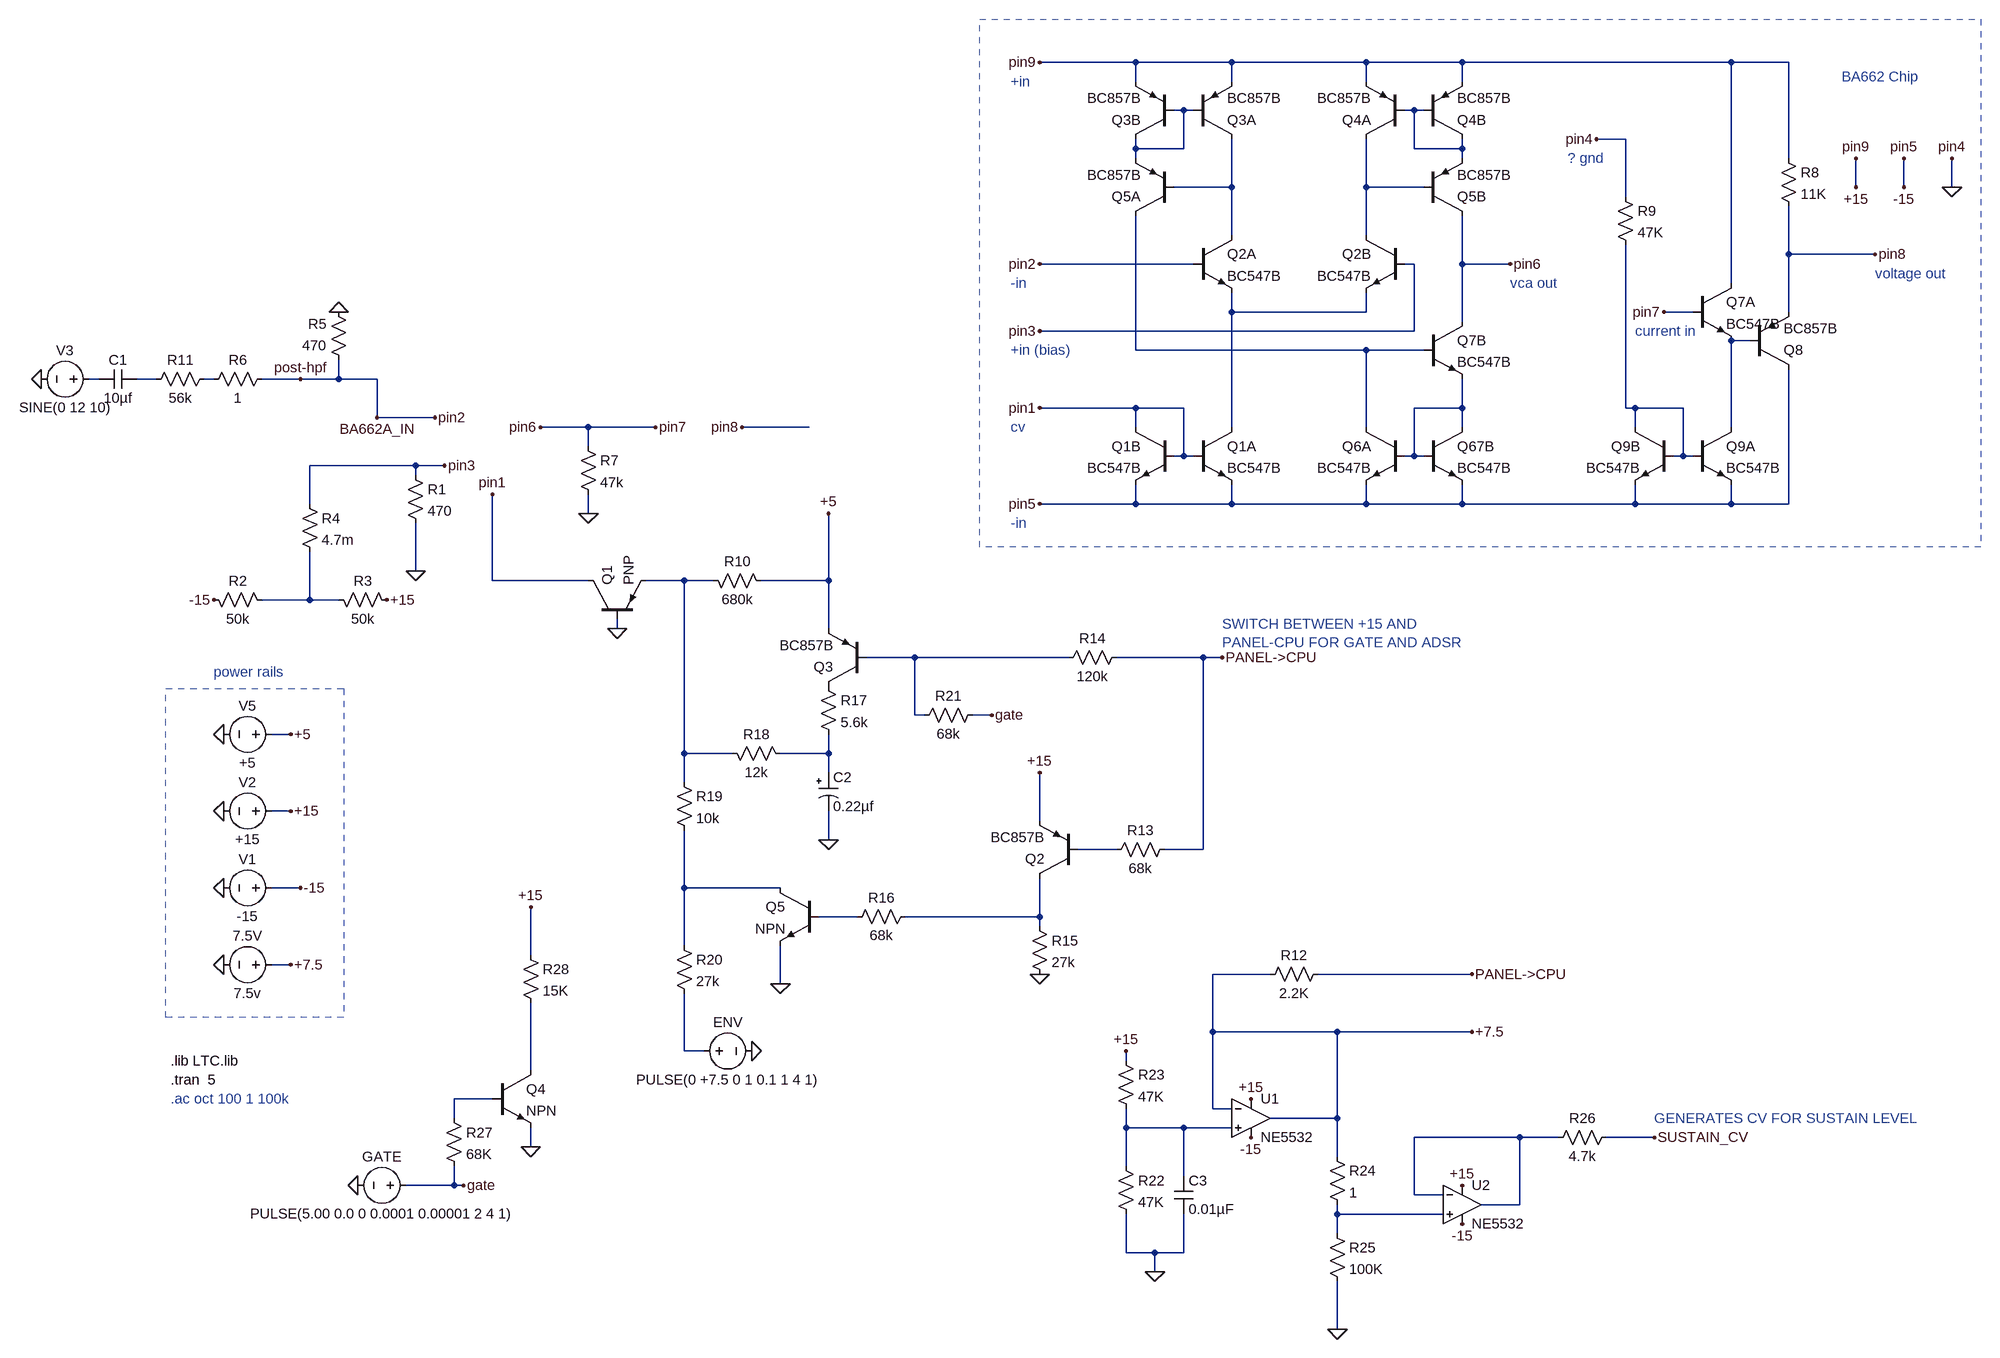
[diagram p0: schematic BA662A VCA (Juno Implementation).asc]
BA662A VCA (Juno Implementation).asc, the LTspice schematic file:
Version 4
SHEET 1 3104 2628
WIRE 1376 -208 1216 -208
WIRE 1536 -208 1376 -208
WIRE 1760 -208 1536 -208
WIRE 1920 -208 1760 -208
WIRE 2368 -208 1920 -208
WIRE 2464 -208 2368 -208
WIRE 1376 -176 1376 -208
WIRE 1536 -176 1536 -208
WIRE 1760 -176 1760 -208
WIRE 1920 -176 1920 -208
WIRE 1456 -128 1440 -128
WIRE 1472 -128 1456 -128
WIRE 1840 -128 1824 -128
WIRE 1856 -128 1840 -128
WIRE 2192 -80 2144 -80
WIRE 1376 -64 1376 -80
WIRE 1456 -64 1456 -128
WIRE 1456 -64 1376 -64
WIRE 1840 -64 1840 -128
WIRE 1920 -64 1920 -80
WIRE 1920 -64 1840 -64
WIRE 1376 -48 1376 -64
WIRE 1920 -48 1920 -64
WIRE 2464 -48 2464 -208
WIRE 1536 0 1536 -80
WIRE 1536 0 1440 0
WIRE 1760 0 1760 -80
WIRE 1856 0 1760 0
WIRE 2576 0 2576 -48
WIRE 2656 0 2656 -48
WIRE 2736 0 2736 -48
WIRE 2192 16 2192 -80
WIRE 1536 80 1536 0
WIRE 1760 80 1760 0
WIRE 2464 112 2464 32
WIRE 2608 112 2464 112
WIRE 1472 128 1216 128
WIRE 1840 128 1824 128
WIRE 1920 128 1920 48
WIRE 2000 128 1920 128
WIRE 2368 160 2368 -208
WIRE 1536 208 1536 176
WIRE 1760 208 1760 176
WIRE 1760 208 1536 208
WIRE 2304 208 2256 208
WIRE 2464 208 2464 112
WIRE 1920 224 1920 128
WIRE 1840 240 1840 128
WIRE 1840 240 1216 240
WIRE 2400 256 2368 256
WIRE 1376 272 1376 48
WIRE 1760 272 1376 272
WIRE 1856 272 1760 272
WIRE -352 320 -368 320
WIRE -256 320 -288 320
WIRE -160 320 -176 320
WIRE -16 320 -80 320
WIRE 48 320 48 288
WIRE 48 320 -16 320
WIRE 112 320 48 320
WIRE 1376 368 1216 368
WIRE 1456 368 1376 368
WIRE 1920 368 1920 320
WIRE 1920 368 1840 368
WIRE 2192 368 2192 96
WIRE 2208 368 2192 368
WIRE 2288 368 2208 368
WIRE 112 384 112 320
WIRE 208 384 112 384
WIRE 464 400 384 400
WIRE 576 400 464 400
WIRE 832 400 720 400
WIRE 1376 400 1376 368
WIRE 1536 400 1536 208
WIRE 1760 400 1760 272
WIRE 1920 400 1920 368
WIRE 2208 400 2208 368
WIRE 2368 400 2368 256
WIRE 464 432 464 400
WIRE 1456 448 1456 368
WIRE 1456 448 1440 448
WIRE 1472 448 1456 448
WIRE 1840 448 1840 368
WIRE 1840 448 1824 448
WIRE 1856 448 1840 448
WIRE 2288 448 2288 368
WIRE 2288 448 2272 448
WIRE 2304 448 2288 448
WIRE 176 464 0 464
WIRE 224 464 176 464
WIRE 176 480 176 464
WIRE 0 528 0 464
WIRE 1376 528 1376 496
WIRE 1376 528 1216 528
WIRE 1536 528 1536 496
WIRE 1536 528 1376 528
WIRE 1760 528 1760 496
WIRE 1760 528 1536 528
WIRE 1920 528 1920 496
WIRE 1920 528 1760 528
WIRE 2208 528 2208 496
WIRE 2208 528 1920 528
WIRE 2368 528 2368 496
WIRE 2368 528 2208 528
WIRE 2464 528 2464 304
WIRE 2464 528 2368 528
WIRE 464 544 464 512
WIRE 176 640 176 560
WIRE 304 656 304 512
WIRE 464 656 304 656
WIRE 624 656 560 656
WIRE 672 656 624 656
WIRE 864 656 864 544
WIRE 864 656 752 656
WIRE 0 688 0 608
WIRE 0 688 -80 688
WIRE 48 688 0 688
WIRE 512 736 512 720
WIRE 864 736 864 656
WIRE 1008 784 928 784
WIRE 1264 784 1008 784
WIRE 1488 784 1344 784
WIRE 1520 784 1488 784
WIRE 1008 880 1008 784
WIRE 1024 880 1008 880
WIRE 1136 880 1104 880
WIRE -32 912 -64 912
WIRE 624 944 624 656
WIRE 704 944 624 944
WIRE 864 944 864 912
WIRE 864 944 784 944
WIRE 864 976 864 944
WIRE 624 992 624 944
WIRE -32 1040 -64 1040
WIRE 1216 1056 1216 976
WIRE 864 1088 864 1040
WIRE 1344 1104 1280 1104
WIRE 1488 1104 1488 784
WIRE 1488 1104 1424 1104
WIRE -16 1168 -64 1168
WIRE 624 1168 624 1072
WIRE 784 1168 624 1168
WIRE 912 1216 848 1216
WIRE 1216 1216 1216 1152
WIRE 1216 1216 992 1216
WIRE 1216 1232 1216 1216
WIRE 624 1264 624 1168
WIRE 368 1280 368 1200
WIRE -32 1296 -64 1296
WIRE 1600 1312 1504 1312
WIRE 1936 1312 1680 1312
WIRE 784 1328 784 1264
WIRE 1504 1408 1504 1312
WIRE 1712 1408 1504 1408
WIRE 1936 1408 1712 1408
WIRE 624 1440 624 1344
WIRE 656 1440 624 1440
WIRE 1360 1456 1360 1440
WIRE 368 1472 368 1360
WIRE 304 1520 240 1520
WIRE 1504 1536 1504 1408
WIRE 1536 1536 1504 1536
WIRE 240 1552 240 1520
WIRE 1712 1552 1712 1408
WIRE 1712 1552 1600 1552
WIRE 1360 1568 1360 1536
WIRE 1456 1568 1360 1568
WIRE 1536 1568 1456 1568
WIRE 2016 1584 1840 1584
WIRE 2080 1584 2016 1584
WIRE 2240 1584 2160 1584
WIRE 368 1600 368 1568
WIRE 1712 1616 1712 1552
WIRE 1360 1632 1360 1568
WIRE 1456 1648 1456 1568
WIRE 240 1664 240 1632
WIRE 240 1664 160 1664
WIRE 256 1664 240 1664
WIRE 1840 1680 1840 1584
WIRE 1888 1680 1840 1680
WIRE 2016 1696 2016 1584
WIRE 2016 1696 1952 1696
WIRE 1712 1712 1712 1696
WIRE 1888 1712 1712 1712
WIRE 1712 1744 1712 1712
WIRE 1360 1776 1360 1712
WIRE 1408 1776 1360 1776
WIRE 1456 1776 1456 1712
WIRE 1456 1776 1408 1776
WIRE 1408 1808 1408 1776
WIRE 1712 1904 1712 1824
FLAG -144 1168 0
FLAG -144 1040 0
FLAG -32 1040 +15
FLAG -16 1168 -15
FLAG -448 320 0
FLAG 176 640 0
FLAG 128 688 +15
FLAG -160 688 -15
FLAG 48 208 0
FLAG 1216 -208 pin9
FLAG 2608 112 pin8
FLAG 2256 208 pin7
FLAG 2000 128 pin6
FLAG 1216 528 pin5
FLAG 1216 240 pin3
FLAG 1216 128 pin2
FLAG 1216 368 pin1
FLAG 2144 -80 pin4
FLAG 224 464 pin3
FLAG 208 384 pin2
FLAG 2576 -48 pin9
FLAG 2656 -48 pin5
FLAG 2736 -48 pin4
FLAG 2576 0 +15
FLAG 2656 0 -15
FLAG 2736 0 0
FLAG 384 400 pin6
FLAG 304 512 pin1
FLAG 464 544 0
FLAG 576 400 pin7
FLAG 720 400 pin8
FLAG 112 384 BA662A_IN
FLAG 512 736 0
FLAG -144 912 0
FLAG -32 912 +5
FLAG 1520 784 PANEL->CPU
FLAG 1216 976 +15
FLAG 1216 1312 0
FLAG 80 1664 0
FLAG 736 1440 0
FLAG 864 544 +5
FLAG 864 1088 0
FLAG 1136 880 gate
FLAG -144 1296 0
FLAG 256 1664 gate
FLAG -16 320 post-hpf
FLAG 1568 1520 +15
FLAG 1568 1584 -15
FLAG -32 1296 +7.5
FLAG 1936 1408 +7.5
FLAG 1936 1312 PANEL->CPU
FLAG 1408 1808 0
FLAG 1360 1440 +15
FLAG 1712 1904 0
FLAG 1920 1664 +15
FLAG 1920 1728 -15
FLAG 368 1600 0
FLAG 368 1200 +15
FLAG 784 1328 0
FLAG 2240 1584 SUSTAIN_CV
SYMBOL voltage -48 1168 M270
WINDOW 0 32 56 VTop 2
WINDOW 3 -32 56 VBottom 2
SYMATTR InstName V1
SYMATTR Value -15
SYMATTR Value2 AC 1
SYMBOL voltage -48 1040 M270
WINDOW 0 32 56 VTop 2
WINDOW 3 -32 56 VBottom 2
SYMATTR InstName V2
SYMATTR Value +15
SYMATTR Value2 AC 1
SYMBOL voltage -352 320 M270
WINDOW 0 32 56 VTop 2
WINDOW 3 -32 56 VBottom 2
SYMATTR InstName V3
SYMATTR Value SINE(0 12 10)
SYMATTR Value2 AC 1
SYMBOL res 160 464 R0
SYMATTR InstName R1
SYMATTR Value 470
SYMBOL res -64 704 M270
WINDOW 0 32 56 VTop 2
WINDOW 3 0 56 VBottom 2
SYMATTR InstName R2
SYMATTR Value 50k
SYMBOL res 144 704 M270
WINDOW 0 32 56 VTop 2
WINDOW 3 0 56 VBottom 2
SYMATTR InstName R3
SYMATTR Value 50k
SYMBOL res -16 512 R0
SYMATTR InstName R4
SYMATTR Value 4.7m
SYMBOL res 64 304 R180
WINDOW 0 36 76 Left 2
WINDOW 3 36 40 Left 2
SYMATTR InstName R5
SYMATTR Value 470
SYMBOL res -64 304 R90
WINDOW 0 0 56 VBottom 2
WINDOW 3 32 56 VTop 2
SYMATTR InstName R6
SYMATTR Value 1
SYMBOL cap -288 304 R90
WINDOW 0 0 32 VBottom 2
WINDOW 3 32 32 VTop 2
SYMATTR InstName C1
SYMATTR Value 10µf
SYMBOL npn 1472 80 R0
SYMATTR InstName Q2A
SYMATTR Value BC547B
SYMBOL pnp 1440 -80 R180
SYMATTR InstName Q3B
SYMATTR Value BC857B
SYMBOL pnp 1472 -80 M180
SYMATTR InstName Q3A
SYMATTR Value BC857B
SYMBOL pnp 1440 48 R180
SYMATTR InstName Q5A
SYMATTR Value BC857B
SYMBOL npn 1472 400 R0
SYMATTR InstName Q1A
SYMATTR Value BC547B
SYMBOL npn 1440 400 M0
SYMATTR InstName Q1B
SYMATTR Value BC547B
SYMBOL npn 1824 80 M0
SYMATTR InstName Q2B
SYMATTR Value BC547B
SYMBOL pnp 1856 -80 M180
SYMATTR InstName Q4B
SYMATTR Value BC857B
SYMBOL pnp 1824 -80 R180
SYMATTR InstName Q4A
SYMATTR Value BC857B
SYMBOL pnp 1856 48 M180
SYMATTR InstName Q5B
SYMATTR Value BC857B
SYMBOL npn 1824 400 M0
SYMATTR InstName Q6A
SYMATTR Value BC547B
SYMBOL npn 1856 400 R0
SYMATTR InstName Q67B
SYMATTR Value BC547B
SYMBOL npn 1856 224 R0
SYMATTR InstName Q7B
SYMATTR Value BC547B
SYMBOL npn 2272 400 M0
SYMATTR InstName Q9B
SYMATTR Value BC547B
SYMBOL npn 2304 400 R0
SYMATTR InstName Q9A
SYMATTR Value BC547B
SYMBOL pnp 2400 304 M180
SYMATTR InstName Q8
SYMATTR Value BC857B
SYMBOL npn 2304 160 R0
SYMATTR InstName Q7A
SYMATTR Value BC547B
SYMBOL res 2448 -64 R0
SYMATTR InstName R8
SYMATTR Value 11K
SYMBOL res 2176 0 R0
SYMATTR InstName R9
SYMATTR Value 47K
SYMBOL res 448 416 R0
SYMATTR InstName R7
SYMATTR Value 47k
SYMBOL pnp 464 720 R270
SYMATTR InstName Q1
SYMBOL res 768 672 M270
WINDOW 0 32 56 VTop 2
WINDOW 3 0 56 VBottom 2
SYMATTR InstName R10
SYMATTR Value 680k
SYMBOL voltage -48 912 M270
WINDOW 0 32 56 VTop 2
WINDOW 3 -32 56 VBottom 2
SYMATTR InstName V5
SYMATTR Value +5
SYMATTR Value2 AC 1
SYMBOL res 1440 1088 R90
WINDOW 0 0 56 VBottom 2
WINDOW 3 32 56 VTop 2
SYMATTR InstName R13
SYMATTR Value 68k
SYMBOL res 1360 768 R90
WINDOW 0 0 56 VBottom 2
WINDOW 3 32 56 VTop 2
SYMATTR InstName R14
SYMATTR Value 120k
SYMBOL pnp 1280 1152 R180
SYMATTR InstName Q2
SYMATTR Value BC857B
SYMBOL res 1200 1216 R0
SYMATTR InstName R15
SYMATTR Value 27k
SYMBOL res 1008 1200 R90
WINDOW 0 0 56 VBottom 2
WINDOW 3 32 56 VTop 2
SYMATTR InstName R16
SYMATTR Value 68k
SYMBOL voltage 176 1664 R90
WINDOW 0 -32 56 VBottom 2
WINDOW 3 32 56 VTop 2
SYMATTR InstName GATE
SYMATTR Value PULSE(5.00 0.0 0 0.0001 0.00001 2 4 1)
SYMATTR Value2 AC 1
SYMBOL voltage 640 1440 R270
WINDOW 0 32 56 VTop 2
WINDOW 3 -32 56 VBottom 2
SYMATTR InstName ENV
SYMATTR Value PULSE(0 +7.5 0 1 0.1 1 4 1)
SYMATTR Value2 AC 1
SYMBOL pnp 928 832 R180
SYMATTR InstName Q3
SYMATTR Value BC857B
SYMBOL res 848 816 R0
SYMATTR InstName R17
SYMATTR Value 5.6k
SYMBOL res 800 960 M270
WINDOW 0 32 56 VTop 2
WINDOW 3 0 56 VBottom 2
SYMATTR InstName R18
SYMATTR Value 12k
SYMBOL res 608 976 R0
SYMATTR InstName R19
SYMATTR Value 10k
SYMBOL res 608 1248 R0
SYMATTR InstName R20
SYMATTR Value 27k
SYMBOL res 1120 864 R90
WINDOW 0 0 56 VBottom 2
WINDOW 3 32 56 VTop 2
SYMATTR InstName R21
SYMATTR Value 68k
SYMBOL polcap 848 976 R0
SYMATTR InstName C2
SYMATTR Value 0.22µf
SYMBOL voltage -48 1296 M270
WINDOW 0 32 56 VTop 2
WINDOW 3 -32 56 VBottom 2
SYMATTR InstName 7.5V
SYMATTR Value 7.5v
SYMATTR Value2 AC 1
SYMBOL res -160 304 R90
WINDOW 0 0 56 VBottom 2
WINDOW 3 32 56 VTop 2
SYMATTR InstName R11
SYMATTR Value 56k
SYMBOL OpAmps/opamp2 1568 1488 R0
SYMATTR InstName U1
SYMATTR Value NE5532
SYMBOL res 1696 1296 R90
WINDOW 0 0 56 VBottom 2
WINDOW 3 32 56 VTop 2
SYMATTR InstName R12
SYMATTR Value 2.2K
SYMBOL res 1344 1616 R0
SYMATTR InstName R22
SYMATTR Value 47K
SYMBOL cap 1440 1648 R0
SYMATTR InstName C3
SYMATTR Value 0.01µF
SYMBOL res 1344 1440 R0
SYMATTR InstName R23
SYMATTR Value 47K
SYMBOL res 1696 1600 R0
SYMATTR InstName R24
SYMATTR Value 1
SYMBOL res 1696 1728 R0
SYMATTR InstName R25
SYMATTR Value 100K
SYMBOL OpAmps/opamp2 1920 1632 R0
SYMATTR InstName U2
SYMATTR Value NE5532
SYMBOL res 2176 1568 R90
WINDOW 0 0 56 VBottom 2
WINDOW 3 32 56 VTop 2
SYMATTR InstName R26
SYMATTR Value 4.7k
SYMBOL res 224 1536 R0
SYMATTR InstName R27
SYMATTR Value 68K
SYMBOL npn3 304 1472 R0
SYMATTR InstName Q4
SYMBOL res 352 1264 R0
SYMATTR InstName R28
SYMATTR Value 15K
SYMBOL npn 848 1168 M0
SYMATTR InstName Q5
TEXT -232 1488 Left 2 !.tran  5
TEXT -232 1520 Left 2 ;.ac oct 100 1 100k
TEXT -232 1456 Left 2 !.lib LTC.lib
TEXT 1168 400 Left 2 ;cv
TEXT 1168 272 Left 2 ;+in (bias)
TEXT 1168 160 Left 2 ;-in
TEXT 1168 -176 Left 2 ;+in
TEXT 1168 560 Left 2 ;-in
TEXT 2000 160 Left 2 ;vca out
TEXT 2096 -48 Left 2 ;? gnd
TEXT 2208 240 Left 2 ;current in
TEXT 2608 144 Left 2 ;voltage out
TEXT 2552 -184 Left 2 ;BA662 Chip
TEXT -160 808 Left 2 ;power rails
TEXT 1520 728 Left 2 ;SWITCH BETWEEN +15 AND \nPANEL-CPU FOR GATE AND ADSR
TEXT 2240 1552 Left 2 ;GENERATES CV FOR SUSTAIN LEVEL
RECTANGLE Normal 1116 -280 2784 600 2
RECTANGLE Normal -240 836 56 1384 2

The netlist it stands for:
* BA662A VCA (Juno Implementation).asc
V1 pin5 0 -15 AC 1
V2 pin9 0 +15 AC 1
V3 N008 0 SINE(0 12 10) AC 1
R1 pin3 0 470
R2 N014 pin5 50k
R3 pin9 N014 50k
R4 pin3 N014 4.7m
R5 post-hpf 0 470
R6 post-hpf N010 1
C1 N009 N008 10µf
Q2A N003 post-hpf N005 0 BC547B
Q3B N001 N001 pin9 0 BC857B
Q3A N003 N001 pin9 0 BC857B
Q5A N007 N003 N001 0 BC857B
Q1A N005 pin1 pin5 0 BC547B
Q1B pin1 pin1 pin5 0 BC547B
Q2B N004 pin3 N005 0 BC547B
Q4B N002 N002 pin9 0 BC857B
Q4A N004 N002 pin9 0 BC857B
Q5B pin6 N004 N002 0 BC857B
Q6A N007 N011 pin5 0 BC547B
Q67B N011 N011 pin5 0 BC547B
Q7B pin6 N007 N011 0 BC547B
Q9B N012 N012 pin5 0 BC547B
Q9A N006 N012 pin5 0 BC547B
Q8 pin5 N006 pin8 0 BC857B
Q7A pin9 pin6 N006 0 BC547B
R8 pin9 pin8 11K
R9 0 N012 47K
R7 pin6 0 47k
Q1 pin1 0 N013 0 PNP
R10 +5 N013 680k
V5 +5 0 +5 AC 1
R13 PANEL->CPU N017 68k
R14 PANEL->CPU N015 120k
Q2 N020 N017 pin9 0 BC857B
R15 N020 0 27k
R16 N020 N019 68k
V§GATE gate 0 PULSE(5.00 0.0 0 0.0001 0.00001 2 4 1) AC 1
V§ENV N021 0 PULSE(0 +7.5 0 1 0.1 1 4 1) AC 1
Q3 P001 N015 +5 0 BC857B
R17 P001 N016 5.6k
R18 N016 N013 12k
R19 N013 N018 10k
R20 N018 N021 27k
R21 gate N015 68k
C2 N016 0 0.22µf
V§7.5V +7.5 0 7.5v AC 1
R11 N010 N009 56k
XU1 N024 +7.5 pin9 pin5 +7.5 NE5532  ; pins In+ In- V+ V- OUT
R12 PANEL->CPU +7.5 2.2K
R22 N024 0 47K
C3 N024 0 0.01µF
R23 pin9 N024 47K
R24 +7.5 N026 1
R25 N026 0 100K
XU2 N026 N025 pin9 pin5 N025 NE5532  ; pins In+ In- V+ V- OUT
R26 SUSTAIN_CV N025 4.7k
R27 N023 gate 68K
Q4 N022 N023 0 0 NPN
R28 pin9 N022 15K
Q5 N018 N019 0 0 NPN
.model NPN NPN
.model PNP PNP
.lib standard.bjt
.tran  5
* .ac oct 100 1 100k
.lib LTC.lib
* cv
* +in (bias)
* -in
* +in
* -in
* vca out
* ? gnd
* current in
* voltage out
* BA662 Chip
* power rails
* SWITCH BETWEEN +15 AND
* PANEL-CPU FOR GATE AND ADSR
* GENERATES CV FOR SUSTAIN LEVEL
.backanno
.end